# Altium schematic sheet ATSAM3X8E Main Controller.SchDoc
size C
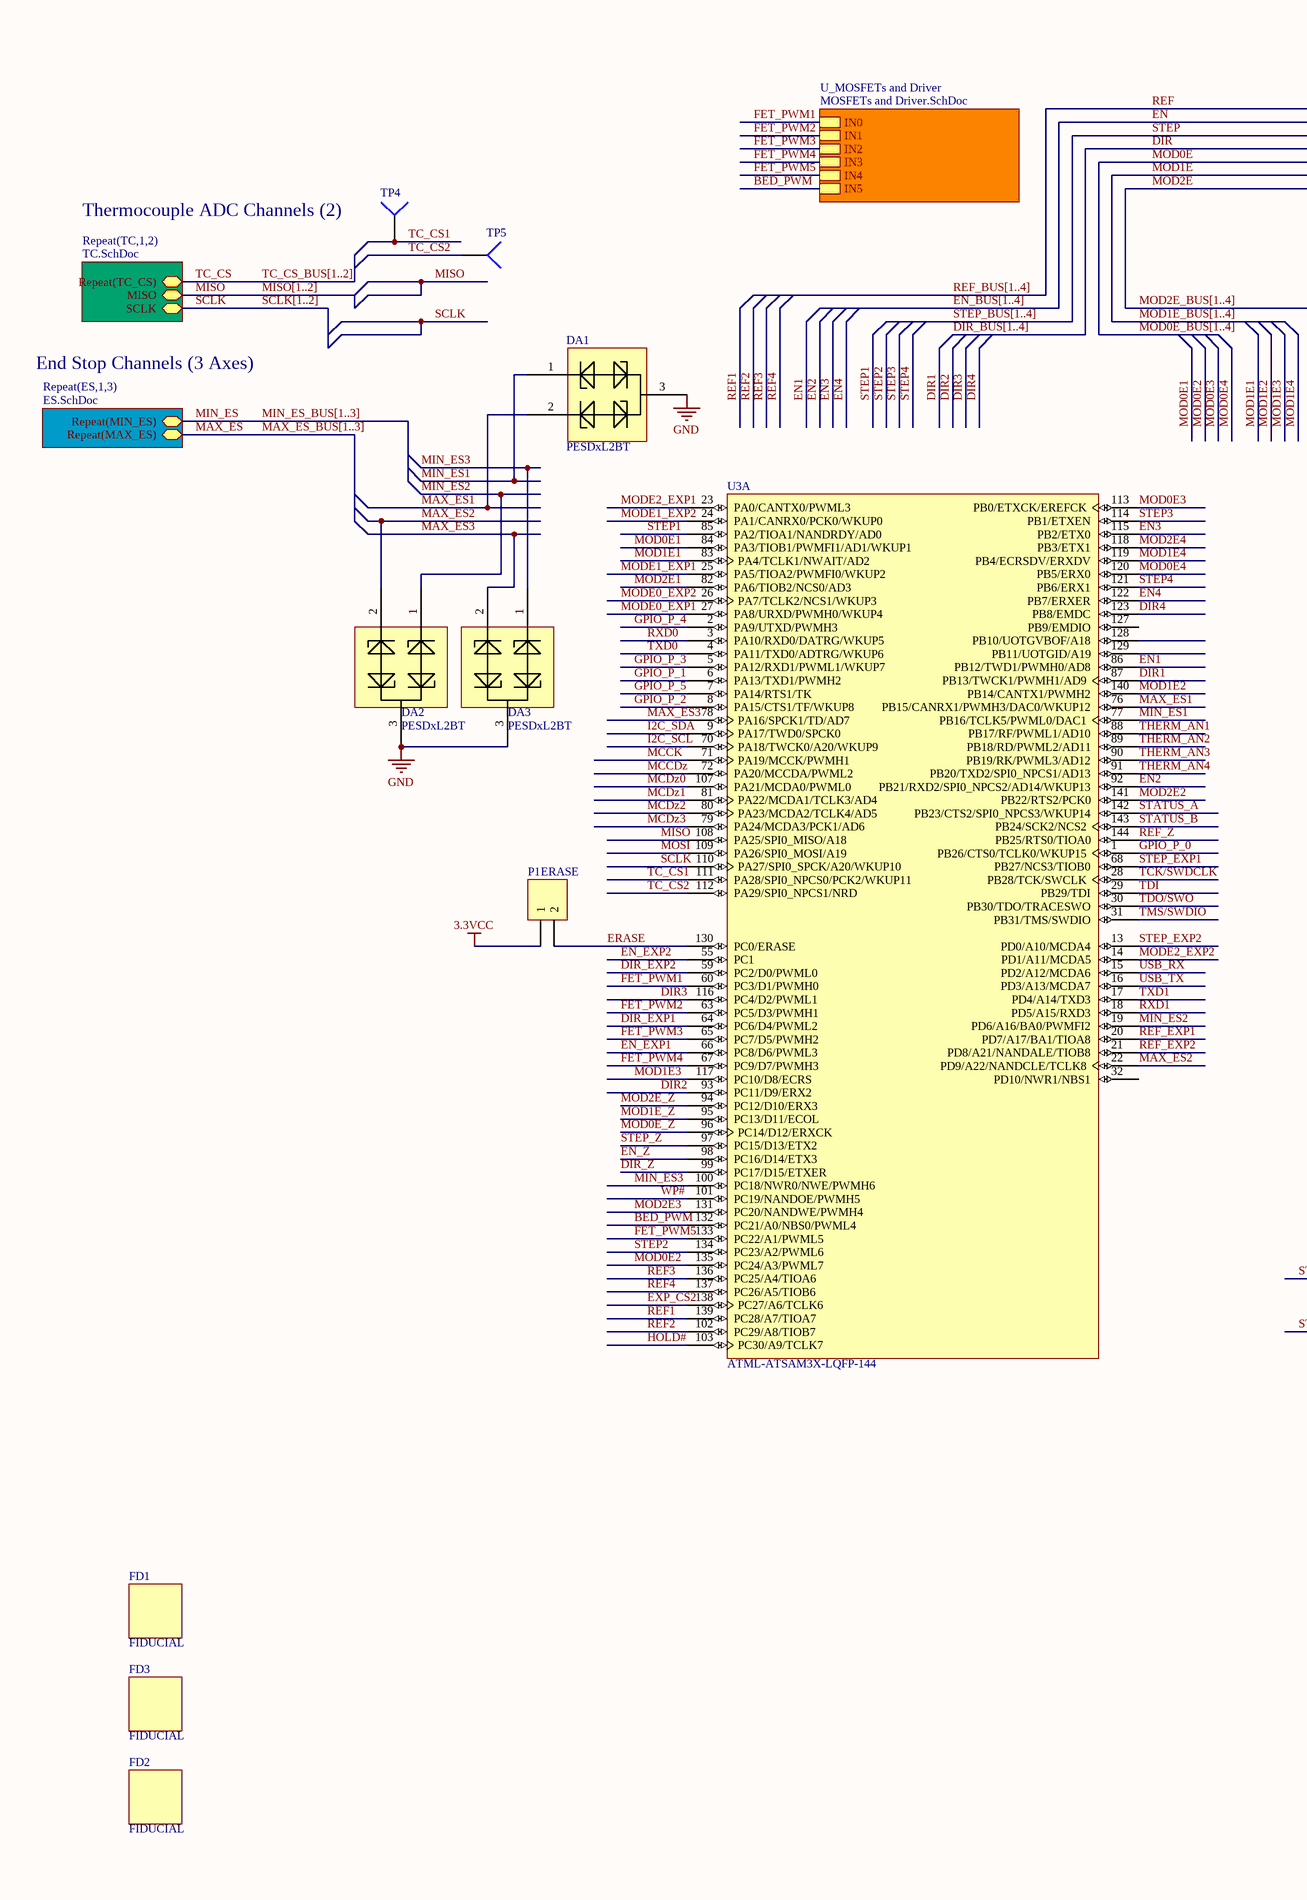
[diagram p0: ATSAM3X8E Main Controller.SchDoc, left]
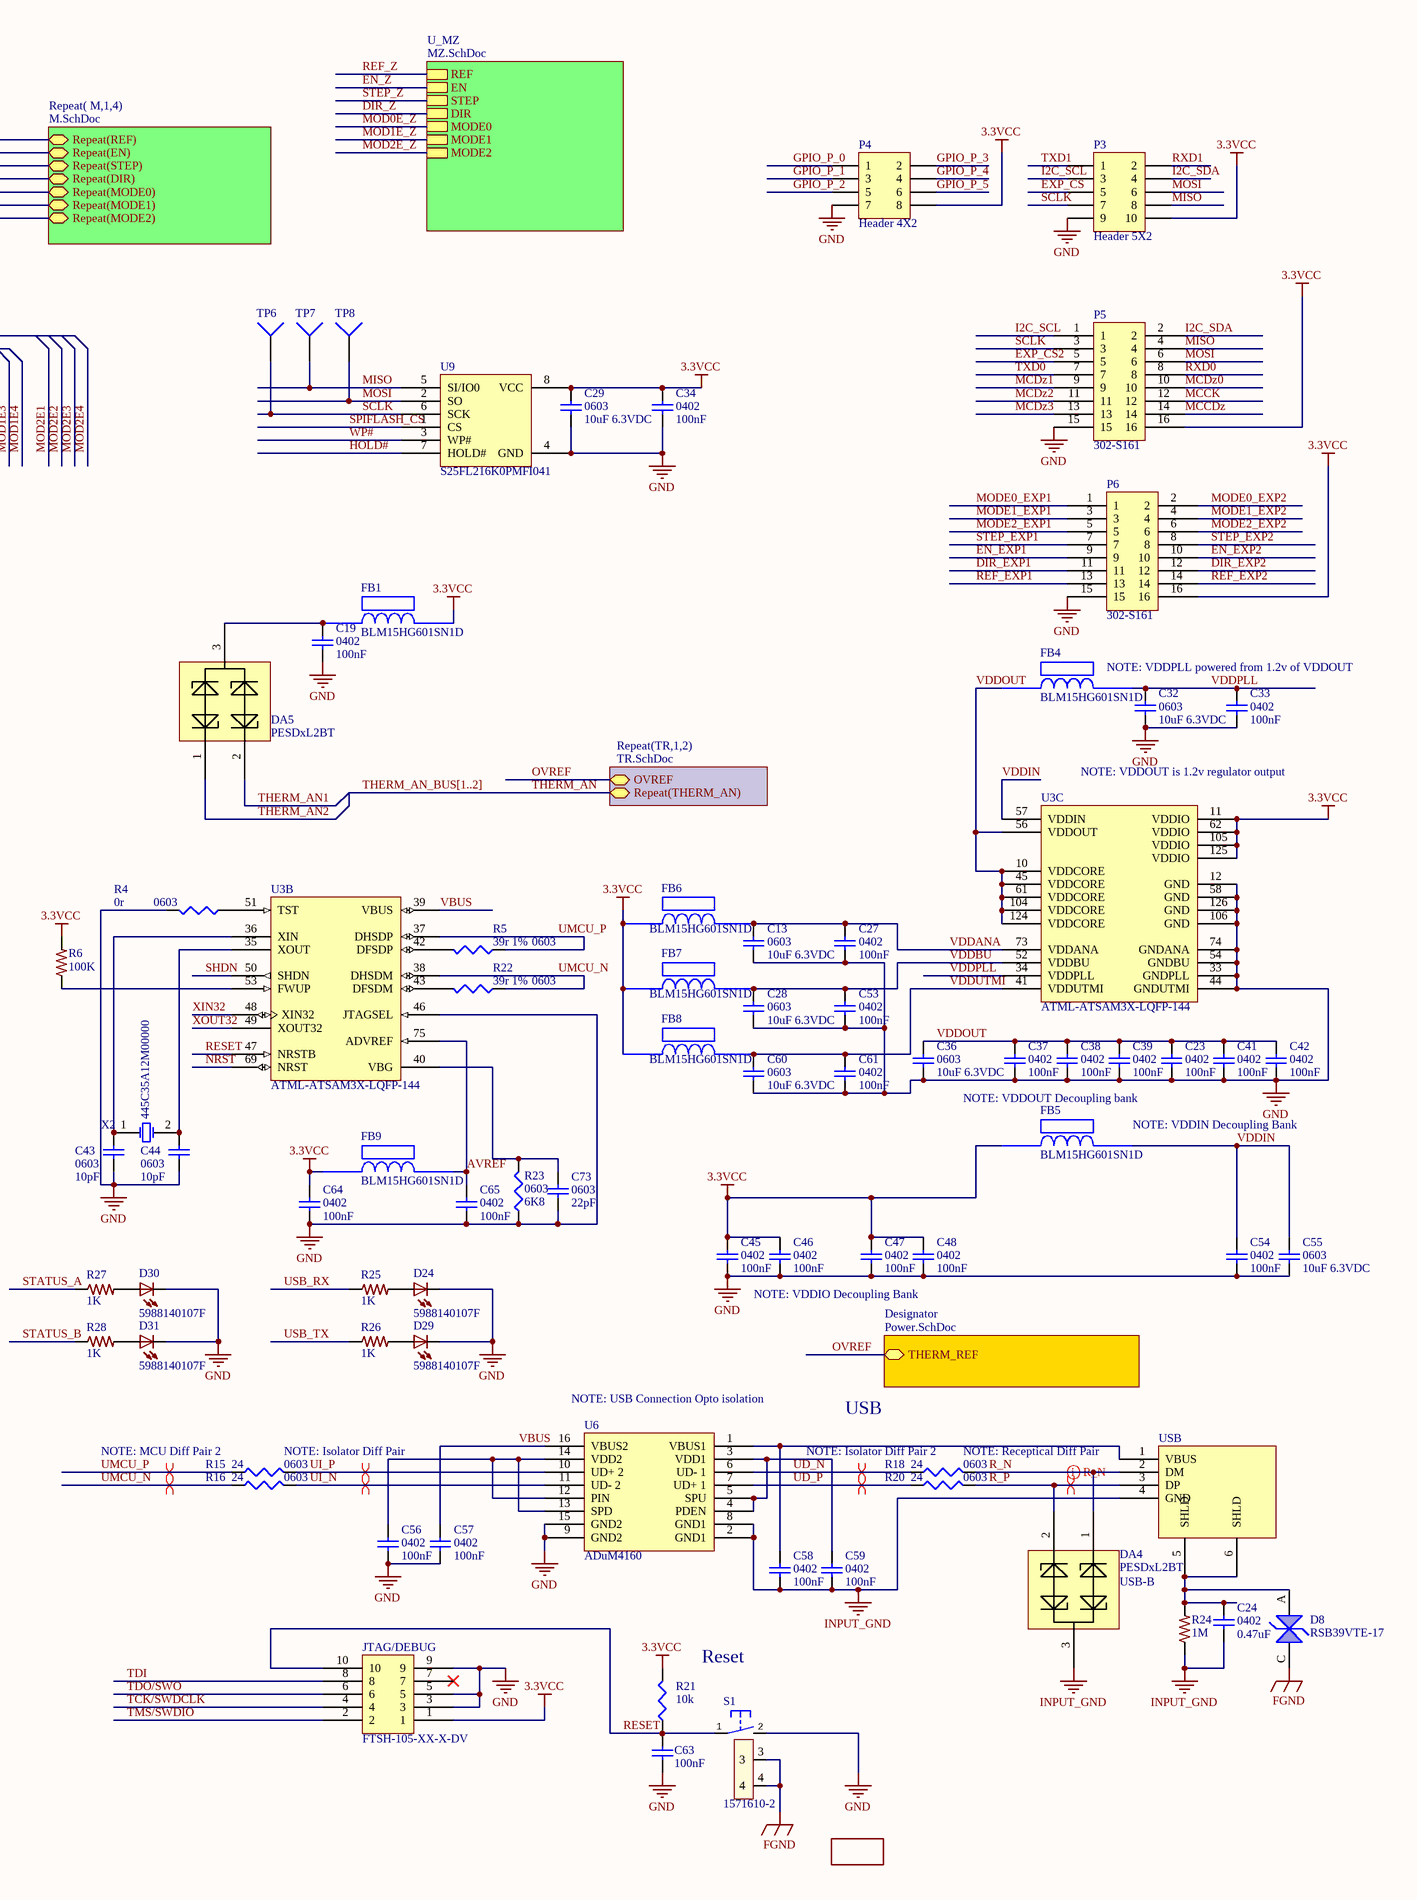
[diagram p1: ATSAM3X8E Main Controller.SchDoc, right]

## Parts
C13  0603  value 10uF 6.3VDC  [C0603]
C19  value 100nF  [C0402]  (hidden comment: 0402)
C23  value 100nF  [C0402]  (hidden comment: 0402)
C24  value 0.47uF  [C0402]  (hidden comment: 0402)
C27  value 100nF  [C0402]  (hidden comment: 0402)
C28  0603  value 10uF 6.3VDC  [C0603]
C29  0603  value 10uF 6.3VDC  [C0603]
C32  0603  value 10uF 6.3VDC  [C0603]
C33  value 100nF  [C0402]  (hidden comment: 0402)
C34  value 100nF  [C0402]  (hidden comment: 0402)
C36  0603  value 10uF 6.3VDC  [C0603]
C37  value 100nF  [C0402]  (hidden comment: 0402)
C38  value 100nF  [C0402]  (hidden comment: 0402)
C39  value 100nF  [C0402]  (hidden comment: 0402)
C41  value 100nF  [C0402]  (hidden comment: 0402)
C42  value 100nF  [C0402]  (hidden comment: 0402)
C43  0603  value 10pF  [1608[0603]]
C44  0603  value 10pF  [1608[0603]]
C45  value 100nF  [C0402]  (hidden comment: 0402)
C46  value 100nF  [C0402]  (hidden comment: 0402)
C47  value 100nF  [C0402]  (hidden comment: 0402)
C48  value 100nF  [C0402]  (hidden comment: 0402)
C53  value 100nF  [C0402]  (hidden comment: 0402)
C54  value 100nF  [C0402]  (hidden comment: 0402)
C55  0603  value 10uF 6.3VDC  [C0603]
C56  value 100nF  [C0402]  (hidden comment: 0402)
C57  value 100nF  [C0402]  (hidden comment: 0402)
C58  value 100nF  [C0402]  (hidden comment: 0402)
C59  value 100nF  [C0402]  (hidden comment: 0402)
C60  0603  value 10uF 6.3VDC  [C0603]
C61  value 100nF  [C0402]  (hidden comment: 0402)
C63  value 100nF  [1608[0603]]  (hidden comment: Cap Semi)
C64  value 100nF  [C0402]  (hidden comment: 0402)
C65  value 100nF  [C0402]  (hidden comment: 0402)
C73  0603  value 22pF  [1608[0603]]
D8  RSB39VTE-17  [SOD323-R]
D24  5988140107F  [LED2012120]
D29  5988140107F  [LED2012120]
D30  5988140107F  [LED2012120]
D31  5988140107F  [LED2012120]
DA1  PESDxL2BT  [SOT95P230X110-3N]
DA2  PESDxL2BT  [SOT95P230X110-3N]
DA3  PESDxL2BT  [SOT95P230X110-3N]
DA4  PESDxL2BT  [SOT95P230X110-3N]
DA5  PESDxL2BT  [SOT95P230X110-3N]
FB1  BLM15HG601SN1D  [BLM18PG121SN1D]
FB4  BLM15HG601SN1D  [BLM18PG121SN1D]
FB5  BLM15HG601SN1D  [BLM18PG121SN1D]
FB6  BLM15HG601SN1D  [BLM18PG121SN1D]
FB7  BLM15HG601SN1D  [BLM18PG121SN1D]
FB8  BLM15HG601SN1D  [BLM18PG121SN1D]
FB9  BLM15HG601SN1D  [BLM18PG121SN1D]
FD1  FIDUCIAL  [FIDUCIAL-1X2]
FD2  FIDUCIAL  [FIDUCIAL-1X2]
FD3  FIDUCIAL  [FIDUCIAL-1X2]
JTAG/DEBUG  FTSH-105-XX-X-DV  [FTSH-105-XX-X-DV]
LOGO1  OSHW_LOGO_8MILX0150-NT  [OSHW_8X150_NOTEXT]  (value not drawn)
P1  ERASE  [HDR1X2]
P3  Header 5X2  [HDR2X5]
P4  Header 4X2  [HDR2X4]
P5  302-S161  [302-S161]
P6  302-S161  [302-S161]
R4  0603  value 0r  [J1-0603]
R5  0603  value 39r 1%  [J1-0603]
R6  100K  [R0603]
R15  0603  value 24  [J1-0603]
R16  0603  value 24  [J1-0603]
R18  0603  value 24  [J1-0603]
R20  0603  value 24  [J1-0603]
R21  value 10k  [J1-0603]  (hidden comment: Res3)
R22  0603  value 39r 1%  [J1-0603]
R23  0603  value 6K8  [J1-0603]
R24  1M  [R0402]
R25  1K  [R0603]
R26  1K  [R0603]
R27  1K  [R0603]
R28  1K  [R0603]
S1  1571610-2  [B3F-31XX]
TP4  TP4  [TP-2]  (value not drawn)
TP5  TP4  [TP-2]  (value not drawn)
TP6  TP4  [TP-2]  (value not drawn)
TP7  TP4  [TP-2]  (value not drawn)
TP8  TP4  [TP-2]  (value not drawn)
U3  ATML-ATSAM3X-LQFP-144  [LQFP144_N]  (parts A,B,C of 3)
U6  ADuM4160  [ADuM4160]
U9  S25FL216K0PMFI041  [S25FL216K0PMFI041]
USB  USB-B  [PN61729]
X2  445C35A12M00000  [445C35A12M00000]

## Sub-sheets
Designator = Power.SchDoc: THERM_REF
Repeat( M,1,4) = M.SchDoc: Repeat(REF), Repeat(EN), Repeat(STEP), Repeat(DIR), Repeat(MODE0), Repeat(MODE1), Repeat(MODE2)
Repeat(ES,1,3) = ES.SchDoc: Repeat(MAX_ES), Repeat(MIN_ES)
Repeat(TC,1,2) = TC.SchDoc: SCLK, MISO, Repeat(TC_CS)
Repeat(TR,1,2) = TR.SchDoc: OVREF, Repeat(THERM_AN)
U_MOSFETs and Driver = MOSFETs and Driver.SchDoc: IN0, IN1, IN2, IN3, IN4, IN5
U_MZ = MZ.SchDoc: REF, EN, STEP, DIR, MODE0, MODE1, MODE2

## Nets
3.3VCC: C29.2 C34.2 C45.2 C46.2 C47.2 C48.2 C64.2 FB1.2 FB5.1 FB6.1 FB7.1 FB8.1 FB9.1 JTAG/DEBUG.1 P1.1 P3.10 P4.8 P5.16 P6.16 R6.2 R21.2 U3.11(VDDIO) U3.62(VDDIO) U3.105(VDDIO) U3.125(VDDIO) U9.8(VCC)
FGND: D8.C S1.3 S1.4
GND: C13.1 C19.1 C23.1 C27.1 C28.1 C29.1 C32.1 C33.1 C34.1 C36.1 C37.1 C38.1 C39.1 C41.1 C42.1 C43.1 C44.1 C45.1 C46.1 C47.1 C48.1 C53.1 C54.1 C55.1 C56.1 C57.1 C60.1 C61.1 C63.1 C64.1 C65.1 C73.1 D24.C D29.C D30.C D31.C DA1.3 DA2.3 DA3.3 JTAG/DEBUG.3 JTAG/DEBUG.5 JTAG/DEBUG.9 P3.9 P4.7 P5.15 P6.15 R4.2 R23.1 S1.2(S) U3.12(GND) U3.33(GNDPLL) U3.44(GNDUTMI) U3.46(JTAGSEL) U3.54(GNDBU) U3.58(GND) U3.74(GNDANA) U3.106(GND) U3.126(GND) U6.9(GND2) U6.15(GND2) U9.4(GND)
INPUT_GND: C24.1 C58.1 C59.1 DA4.3 R24.1 U6.2(GND1) U6.8(GND1) USB.4(GND)
AVREF: C65.2 FB9.2 U3.75(ADVREF)
BED_PWM: U3.132(PC21/A0/NBS0/PWML4) ; sheet U_MOSFETs and Driver/IN5
DIR: sheet Repeat( M,1,4)/Repeat(DIR)
DIR1: U3.87(PB13/TWCK1/PWMH1/AD9)
DIR2: U3.93(PC11/D9/ERX2)
DIR3: U3.116(PC4/D2/PWML1)
DIR4: U3.123(PB8/EMDC)
DIR_EXP1: P6.11 U3.64(PC6/D4/PWML2)
DIR_EXP2: P6.12 U3.59(PC2/D0/PWML0)
DIR_Z: U3.99(PC17/D15/ETXER) ; sheet U_MZ/DIR
EN: sheet Repeat( M,1,4)/Repeat(EN)
EN1: U3.86(PB12/TWD1/PWMH0/AD8)
EN2: U3.92(PB21/RXD2/SPI0_NPCS2/AD14/WKUP13)
EN3: U3.115(PB2/ETX0)
EN4: U3.122(PB7/ERXER)
EN_EXP1: P6.9 U3.66(PC8/D6/PWML3)
EN_EXP2: P6.10 U3.55(PC1)
EN_Z: U3.98(PC16/D14/ETX3) ; sheet U_MZ/EN
ERASE: P1.2 U3.130(PC0/ERASE)
EXP_CS: P3.5
EXP_CS2: P5.5 U3.138(PC27/A6/TCLK6)
FET_PWM1: U3.60(PC3/D1/PWMH0) ; sheet U_MOSFETs and Driver/IN0
FET_PWM2: U3.63(PC5/D3/PWMH1) ; sheet U_MOSFETs and Driver/IN1
FET_PWM3: U3.65(PC7/D5/PWMH2) ; sheet U_MOSFETs and Driver/IN2
FET_PWM4: U3.67(PC9/D7/PWMH3) ; sheet U_MOSFETs and Driver/IN3
FET_PWM5: U3.133(PC22/A1/PWML5) ; sheet U_MOSFETs and Driver/IN4
GPIO_P_0: P4.1 U3.1(PB26/CTS0/TCLK0/WKUP15)
GPIO_P_1: P4.3 U3.6(PA13/TXD1/PWMH2)
GPIO_P_2: P4.5 U3.8(PA15/CTS1/TF/WKUP8)
GPIO_P_3: P4.2 U3.5(PA12/RXD1/PWML1/WKUP7)
GPIO_P_4: P4.4 U3.2(PA9/UTXD/PWMH3)
GPIO_P_5: P4.6 U3.7(PA14/RTS1/TK)
HOLD#: U3.103(PC30/A9/TCLK7) U9.7(HOLD#)
I2C_SCL: P3.3 P5.1 U3.70(PA18/TWCK0/A20/WKUP9)
I2C_SDA: P3.4 P5.2 U3.9(PA17/TWD0/SPCK0)
MAX_ES: sheet Repeat(ES,1,3)/Repeat(MAX_ES)
MAX_ES1: DA1.2 U3.76(PB15/CANRX1/PWMH3/DAC0/WKUP12)
MAX_ES2: DA2.2 U3.22(PD9/A22/NANDCLE/TCLK8)
MAX_ES3: DA3.2 U3.78(PA16/SPCK1/TD/AD7)
MCCDz: P5.14 U3.72(PA20/MCCDA/PWML2)
MCCK: P5.12 U3.71(PA19/MCCK/PWMH1)
MCDz0: P5.10 U3.107(PA21/MCDA0/PWML0)
MCDz1: P5.9 U3.81(PA22/MCDA1/TCLK3/AD4)
MCDz2: P5.11 U3.80(PA23/MCDA2/TCLK4/AD5)
MCDz3: P5.13 U3.79(PA24/MCDA3/PCK1/AD6)
MIN_ES: sheet Repeat(ES,1,3)/Repeat(MIN_ES)
MIN_ES1: DA1.1 U3.77(PB16/TCLK5/PWML0/DAC1)
MIN_ES2: DA2.1 U3.19(PD6/A16/BA0/PWMFI2)
MIN_ES3: DA3.1 U3.100(PC18/NWR0/NWE/PWMH6)
MISO: P3.8 P5.4 TP7.1 U3.108(PA25/SPI0_MISO/A18) U9.5(SI/IO0) ; sheet Repeat(TC,1,2)/MISO
MOD0E: sheet Repeat( M,1,4)/Repeat(MODE0)
MOD0E1: U3.84(PA3/TIOB1/PWMFI1/AD1/WKUP1)
MOD0E2: U3.135(PC24/A3/PWML7)
MOD0E3: U3.113(PB0/ETXCK/EREFCK)
MOD0E4: U3.120(PB5/ERX0)
MOD0E_Z: U3.96(PC14/D12/ERXCK) ; sheet U_MZ/MODE0
MOD1E: sheet Repeat( M,1,4)/Repeat(MODE1)
MOD1E1: U3.83(PA4/TCLK1/NWAIT/AD2)
MOD1E2: U3.140(PB14/CANTX1/PWMH2)
MOD1E3: U3.117(PC10/D8/ECRS)
MOD1E4: U3.119(PB4/ECRSDV/ERXDV)
MOD1E_Z: U3.95(PC13/D11/ECOL) ; sheet U_MZ/MODE1
MOD2E: sheet Repeat( M,1,4)/Repeat(MODE2)
MOD2E1: U3.82(PA6/TIOB2/NCS0/AD3)
MOD2E2: U3.141(PB22/RTS2/PCK0)
MOD2E3: U3.131(PC20/NANDWE/PWMH4)
MOD2E4: U3.118(PB3/ETX1)
MOD2E_Z: U3.94(PC12/D10/ERX3) ; sheet U_MZ/MODE2
MODE0_EXP1: P6.1 U3.27(PA8/URXD/PWMH0/WKUP4)
MODE0_EXP2: P6.2 U3.26(PA7/TCLK2/NCS1/WKUP3)
MODE1_EXP1: P6.3 U3.25(PA5/TIOA2/PWMFI0/WKUP2)
MODE1_EXP2: P6.4 U3.24(PA1/CANRX0/PCK0/WKUP0)
MODE2_EXP1: P6.5 U3.23(PA0/CANTX0/PWML3)
MODE2_EXP2: P6.6 U3.14(PD1/A11/MCDA5)
MOSI: P3.6 P5.6 TP8.1 U3.109(PA26/SPI0_MOSI/A19) U9.2(SO)
NRST: U3.69(NRST)
OVREF: sheet Repeat(TR,1,2)/OVREF, sheet Designator/THERM_REF
R_N: DA4.1 R18.2 USB.2(DM)
R_P: DA4.2 R20.2 USB.3(DP)
REF: sheet Repeat( M,1,4)/Repeat(REF)
REF1: U3.139(PC28/A7/TIOA7)
REF2: U3.102(PC29/A8/TIOB7)
REF3: U3.136(PC25/A4/TIOA6)
REF4: U3.137(PC26/A5/TIOB6)
REF_EXP1: P6.13 U3.20(PD7/A17/BA1/TIOA8)
REF_EXP2: P6.14 U3.21(PD8/A21/NANDALE/TIOB8)
REF_Z: U3.144(PB25/RTS0/TIOA0) ; sheet U_MZ/REF
RESET: C63.2 JTAG/DEBUG.10 R21.1 S1.1(P) U3.47(NRSTB)
RXD0: P5.8 U3.3(PA10/RXD0/DATRG/WKUP5)
RXD1: P3.2 U3.18(PD5/A15/RXD3)
SCLK: P3.7 P5.3 TP6.1 U3.110(PA27/SPI0_SPCK/A20/WKUP10) U9.6(SCK) ; sheet Repeat(TC,1,2)/SCLK
SHDN: U3.50(SHDN)
SPIFLASH_CS: U9.1(CS)
STATUS_A: R27.1 U3.142(PB23/CTS2/SPI0_NPCS3/WKUP14)
STATUS_B: R28.1 U3.143(PB24/SCK2/NCS2)
STEP: sheet Repeat( M,1,4)/Repeat(STEP)
STEP1: U3.85(PA2/TIOA1/NANDRDY/AD0)
STEP2: U3.134(PC23/A2/PWML6)
STEP3: U3.114(PB1/ETXEN)
STEP4: U3.121(PB6/ERX1)
STEP_EXP1: P6.7 U3.68(PB27/NCS3/TIOB0)
STEP_EXP2: P6.8 U3.13(PD0/A10/MCDA4)
STEP_Z: U3.97(PC15/D13/ETX2) ; sheet U_MZ/STEP
TC_CS: sheet Repeat(TC,1,2)/Repeat(TC_CS)
TC_CS1: TP4.1 U3.111(PA28/SPI0_NPCS0/PCK2/WKUP11)
TC_CS2: TP5.1 U3.112(PA29/SPI0_NPCS1/NRD)
TCK/SWDCLK: JTAG/DEBUG.4 U3.28(PB28/TCK/SWCLK)
TDI: JTAG/DEBUG.8 U3.29(PB29/TDI)
TDO/SWO: JTAG/DEBUG.6 U3.30(PB30/TDO/TRACESWO)
THERM_AN: sheet Repeat(TR,1,2)/Repeat(THERM_AN)
THERM_AN1: DA5.2 U3.88(PB17/RF/PWML1/AD10)
THERM_AN2: DA5.1 U3.89(PB18/RD/PWML2/AD11)
THERM_AN3: U3.90(PB19/RK/PWML3/AD12)
THERM_AN4: U3.91(PB20/TXD2/SPI0_NPCS1/AD13)
TMS/SWDIO: JTAG/DEBUG.2 U3.31(PB31/TMS/SWDIO)
TXD0: P5.7 U3.4(PA11/TXD0/ADTRG/WKUP6)
TXD1: P3.1 U3.17(PD4/A14/TXD3)
UD_N: R18.1 U6.6(UD-_1)
UD_P: R20.1 U6.7(UD+_1)
UI_N: R16.2 U6.11(UD-_2)
UI_P: R15.2 U6.10(UD+_2)
UMCU_N: R16.1 R22.1 U3.38(DHSDM)
UMCU_P: R5.1 R15.1 U3.37(DHSDP)
USB_RX: R25.1 U3.15(PD2/A12/MCDA6)
USB_TX: R26.1 U3.16(PD3/A13/MCDA7)
VBUS: C57.2 U3.39(VBUS) U6.16(VBUS2)
VDDANA: C13.2 C27.2 FB6.2 U3.73(VDDANA)
VDDBU: C28.2 C53.2 FB7.2 U3.52(VDDBU)
VDDIN: C54.2 C55.2 FB5.2 U3.57(VDDIN)
VDDOUT: C23.2 C36.2 C37.2 C38.2 C39.2 C41.2 C42.2 FB4.1 U3.10(VDDCORE) U3.45(VDDCORE) U3.56(VDDOUT) U3.61(VDDCORE) U3.104(VDDCORE) U3.124(VDDCORE)
VDDPLL: C32.2 C33.2 FB4.2 U3.34(VDDPLL)
VDDUTMI: C60.2 C61.2 FB8.2 U3.41(VDDUTMI)
WP#: U3.101(PC19/NANDOE/PWMH5) U9.3(WP#)
XIN32: U3.48(XIN32)
XOUT32: U3.49(XOUT32)
NetC19_2: C19.2 DA5.3 FB1.1
NetC24_2: C24.2 D8.A R24.2 USB.5(SHLD) USB.6(SHLD)
NetC43_2: C43.2 U3.36(XIN) X2.1(OSC1)
NetC44_2: C44.2 U3.35(XOUT) X2.2(OSC2)
NetC56_2: C56.2 U6.12(PIN) U6.13(SPD) U6.14(VDD2)
NetC58_2: C58.2 U6.1(VBUS1) USB.1(VBUS)
NetC59_2: C59.2 U6.3(VDD1) U6.4(PDEN) U6.5(SPU)
NetC73_2: C73.2 R23.2 U3.40(VBG)
NetD24_A: D24.A R25.2
NetD29_A: D29.A R26.2
NetD30_A: D30.A R27.2
NetD31_A: D31.A R28.2
NetR4_1: R4.1 U3.51(TST)
NetR5_2: R5.2 U3.42(DFSDP)
NetR6_1: R6.1 U3.53(FWUP)
NetR22_2: R22.2 U3.43(DFSDM)

Not connected (* = marked no-connect by the designer): JTAG/DEBUG 7*; U3 32(PD10/NWR1/NBS1) 127(PB9/EMDIO) 128(PB10/UOTGVBOF/A18) 129(PB11/UOTGID/A19)

## Buses and harness runs
bus DIR_BUS[1..4]
bus EN_BUS[1..4]
bus MAX_ES_BUS[1..3]
bus MIN_ES_BUS[1..3]
bus MISO[1..2]
bus MOD0E_BUS[1..4]
bus MOD1E_BUS[1..4]
bus MOD2E_BUS[1..4]
bus REF_BUS[1..4]
bus SCLK[1..2]
bus STEP_BUS[1..4]
bus TC_CS_BUS[1..2]
bus THERM_AN_BUS[1..2]

## Layout directives
differential pair: R_N, R_P, UD_N, UD_P, UI_N, UI_P, UMCU_N, UMCU_P

## Notes on the sheet
- (near TP4) Thermocouple ADC Channels (2)
- End Stop Channels (3 Axes)
- NOTE: VDDPLL powered from 1.2v of VDDOUT
- NOTE: VDDOUT is 1.2v regulator output
- NOTE: VDDOUT Decoupling bank
- NOTE: VDDIN Decoupling Bank
- NOTE: VDDIO Decoupling Bank
- (near U6) NOTE: USB Connection Opto isolation
- USB
- NOTE: MCU Diff Pair 2
- (near R15) NOTE: Isolator Diff Pair
- (near R18) NOTE: Isolator Diff Pair 2
- (near R18) NOTE: Receptical Diff Pair
- Reset

## Library data of the parts
C13 C28 C29 C32 C36 C55 C60 = C1608JB0J106K080AB: CAP CER 10UF 6.3V 10% JB 0603; MFR: TDK; Voltage: 6.3VDC; Published: 10 - Dec - 2014; LatestRevisionDate: 10 - Dec - 2014; Component Type: Chip Capacitor; MFR Part #: C1608JB0J106K080AB; Part Description: CAP CER 10UF 6.3V 10% JB 0603; Mounting Type: SMT 0603; Datasheet: http://www.tdk.com/pdf/TDKMLCCCapRange.pdf; Height: 0.9mm; Tolerance: 10%; Digikey #: 445-11185-1-ND; PackageReference: 0402
C19 C23 C27 C33 C37-C39 C41 C42 C45-C48 C53 C54 C56-C59 C61 = 100nF C0402 - GRM155R71C104KA88D: Capacitor (Semiconductor SIM Model); MFR: Murata; Part Description: CAP CER 0.1UF 16V 10% X7R 0402; Tolerance: 10%; Voltage: 16v; Published: 10 - Dec - 2014; LatestRevisionDate: 10 - Dec - 2014; LatestRevisionNote: Ultimachine Footprint Added; Publisher: Ultimachine; Component Type: Chip Capacitor; MFR Part #: GRM155R71C104KA88D; Mounting Type: SMT 0402; Datasheet: http://psearch.murata.com/capacitor/product/GRM155R71C104KA88%23.pdf; Height: 0.5 ±0.05mm; PackageReference: 0402
C24 = GRM155R60J474KE19D: 0.47uF 6.3v C0402 - GRM155R60J474KE19D; MFR: Murata; Part Description: CAP CER 0.47UF 6.3V 10% X5R 0402; Tolerance: 10%; Voltage: 6.3VDC; Published: 10 - Dec - 2014; LatestRevisionDate: 10 - Dec - 2014; LatestRevisionNote: Ultimachine Footprint Added; Publisher: Ultimachine; Component Type: Chip Capacitor; MFR Part #: GRM155R60J474KE19D; Mounting Type: SMT 0402; Datasheet: http://search.murata.co.jp/Ceramy/image/img/A01X/G101/ENG/GRM155R60J474KE19-01.pdf; Height: 0.5 ±0.05mm; PackageReference: 0402
C34 C64 C65 = GRM155R71C104KA88D: CAP CER 0.1UF (100nF) 16V 10% X7R 0402; MFR: Murata; Part Description: CAP CER 0.1UF 16V 10% X7R 0402; Published: 10 - Dec - 2014; LatestRevisionDate: 10 - Dec - 2014; LatestRevisionNote: Ultimachine Footprint Added; Publisher: Ultimachine; Component Type: Chip Capacitor; MFR Part #: GRM155R71C104KA88D; Mounting Type: SMT 0402; Datasheet: http://psearch.murata.com/capacitor/product/GRM155R71C104KA88%23.pdf; Height: 0.5 ±0.05mm; Tolerance: 10%; Voltage: 16v; PackageReference: 0402
C43 C44 C63 C73 = Cap Semi: Capacitor (Semiconductor SIM Model); Published: 8-Jun-2000; LatestRevisionDate: 29-May-2009; LatestRevisionNote: IPC-7351 Footprint Added.; PackageReference: C1206; Publisher: Altium Limited; PackageDescription: Chip Capacitor
D8 = RSB39VTE-17: DIODE TVS
D24 D29-D31 = 5988140107F: LED 0805 Yellow; LastRevisionNote: ImportComponents; Published: 23-Apr-2014; Publisher: UltiMachine; LastRevisionDate: 23-Apr-2014; VALUE: 5988140107F
DA1-DA5 = PESDxL2BT: PESDxL2BT TVS Diode Array 2x
JTAG/DEBUG = ARM Cortex JTAG-DEBUG Header
LOGO1 = OSHW_LOGO_8MILX0150-NT: LastRevisionNote: ImportComponents; Published: 23-Apr-2014; Publisher: UltiMachine; LastRevisionDate: 23-Apr-2014
P1 = Header 2: Header, 2-Pin; LatestRevisionDate: 17-Jul-2002; LatestRevisionNote: Re-released for DXP Platform.; Publisher: Altium Limited
P3 = Header 5X2: Header, 5-Pin, Dual row; LatestRevisionDate: 17-Jul-2002; LatestRevisionNote: Re-released for DXP Platform.; Publisher: Altium Limited
P4 = Header 4X2: Header, 4-Pin, Dual row; LatestRevisionDate: 17-Jul-2002; LatestRevisionNote: Re-released for DXP Platform.; Publisher: Altium Limited
P5 P6 = 302-S161: 16 Pos 2.54mm Pin Connector Shrouded; Manufacture: On Shore Technology Inc; Value: 2.54mm Pitch Spacing; Manufature Part #: 302-S161; Datasheet: http://www.on-shore.com/sites/default/files/manuals/302-sxxx.pdf; Digikey Part #: ED10522-ND; Pin Count: 16; Type: Throughhole connector; Mount Type: Through hole; Price: $0.40; Height: 9.1mm
R4 R5 R15 R16 R18 R20-R23 = Res3: Resistor; Published: 8-Jun-2000; LatestRevisionDate: 29-May-2009; LatestRevisionNote: IPC-7351 Footprint Added.; PackageReference: J1-0603; Publisher: Altium Limited; PackageDescription: Chip Resistor
R6 = RC0603FR-07100KL: RES 100K OHM 1/10W 1% 0603 SMD; LastRevisionNote: ImportComponents; Published: 23-Apr-2014; Publisher: UltiMachine; LastRevisionDate: 23-Apr-2014; ManufacturerPartNumber: RC0603FR-07100KL; VALUE: 100K
R24 = ERJ2GEJ105X: RES 0402 1M 100mW 5%; LastRevisionNote: ImportComponents; Published: 23-Apr-2014; Publisher: UltiMachine; LastRevisionDate: 23-Apr-2014; ManufacturerPartNumber: ERJ2GEJ105X; VALUE: 1M
R25-R28 = ERJ-3EKF1001V: RES 0603 1K 100mW 1%; LastRevisionNote: ImportComponents; Published: 23-Apr-2014; Publisher: UltiMachine; LastRevisionDate: 23-Apr-2014; ManufacturerPartNumber: ERJ-3EKF1001V; VALUE: 1K
S1 = 1571610-2_1: SWTCH Momentary Washable; Manufacturer: Omron; Manufacturer: TE; LastRevisionNote: Import; ComponentLink1URL: http://www.te.com/commerce/DocumentDelivery/DDEController?Action=srchrtrv&DocNm=1571610&DocType=Customer+Drawing&DocLang=English; ComponentLink1Description: Datasheet for B3F-31XX; Published: 23-Apr-2014; Publisher: UltiMachine; LastRevisionDate: 23-Apr-2014; ManufacturerPartNumber: 1571610-2; Supplier 1: Mouser; Supplier Part Number 1: 506-1571610-2
TP4-TP8 = Socket: LatestRevisionDate: 17-Jul-2002; LatestRevisionNote: Re-released for DXP Platform.; Publisher: Altium Limited
U6 = ADuM4160: USB Opto Isolator
U9 = S25FL216K0PMFI041: Manufacture: Spansion; Active: Yes; Manufacture Part #: S25FL216K0PMFI041; Mounting Type: SMD; Type: SOIC; Datasheet: http://www.spansion.com/Support/Datasheets/S25FL216K_00.pdf; Digikey Part NUmber: 1274-1052-ND; Price: $0.35
X2 = XTAL: Crystal Oscillator; Published: 8-Jun-2000; LatestRevisionDate: 17-Jul-2002; LatestRevisionNote: Re-released for DXP Platform.; PackageReference: R38; Publisher: Altium Limited; PackageDescription: Crystal, Thru-Hole; 2 Leads; Body 3.1 x 8.2 mm (Dia.xH)